# EAGLE design VFO_RTC_IQ3 (EAGLE 7.3.0)
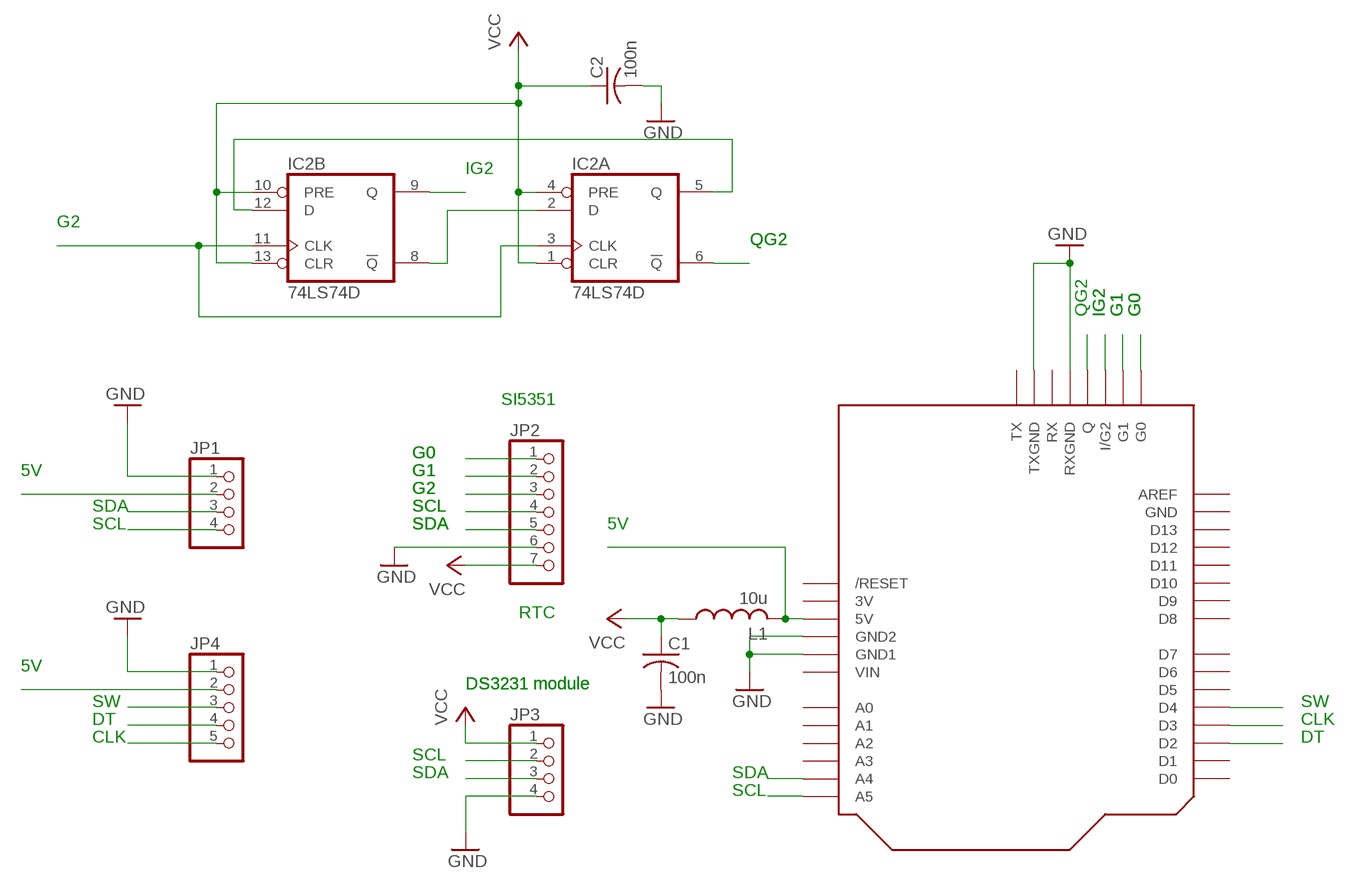
[diagram p0: schematic, sheet 1]

## Parts
C1  100n  C-US050-025X075  [C050-025X075]
C2  100n  C-US050-025X075  [C050-025X075]
IC2  74LS74D  [SO14]
JP1  PINHD-1X4  [1X04]
JP2  PINHD-1X7  [1X07]
JP3  PINHD-1X4  [1X04]
JP4  PINHD-1X5  [1X05]
L1  10u  L-US0207/10  [0207/10]
U$1  RF-SHIELD  [SHIELD-RF]

## Nets
5V: JP1.2 JP4.2 L1.2 U$1.5V
CLK: JP4.5 U$1.D3
DT: JP4.4 U$1.D2
G0: JP2.1 U$1.G0
G1: JP2.2 U$1.G1
G2: IC2.3(A:CLK) IC2.11(B:CLK) JP2.3
GND: C1.2 C2.2 JP1.1 JP2.6 JP3.4 JP4.1 U$1.GND1 U$1.GND2 U$1.RXGND U$1.TXGND
IG2: IC2.9(B:Q) U$1.I/G2
N$4: IC2.2(A:D) IC2.8(B:!Q)
N$7: IC2.5(A:Q) IC2.12(B:D)
QG2: IC2.6(A:!Q) U$1.Q
SCL: JP1.4 JP2.4 JP3.2 U$1.A5
SDA: JP1.3 JP2.5 JP3.3 U$1.A4
SW: JP4.3 U$1.D4
VCC: C1.1 C2.1 IC2.1(A:CLR) IC2.4(A:PRE) IC2.10(B:PRE) IC2.13(B:CLR) JP2.7 JP3.1 L1.1
Unconnected: U$1.A0 U$1.A1 U$1.A2 U$1.A3 U$1.AREF U$1.D0 U$1.D1 U$1.D5 U$1.D6 U$1.D7 U$1.D8 U$1.D9 U$1.D10 U$1.D11 U$1.D12 U$1.D13 U$1.RESET(/RESET) U$1.RX U$1.TX

## Notes on the sheet
- IG2
- G2
- QG2 | QG2
- QG2 | IG2 | IG2 | G1 | G1 | G0 | G0
- SI5351
- G0 | G0
- 5V | G1 | G1
- G2 | G2
- SDA | SCL | SCL
- SCL | SDA | SDA | 5V
- RTC
- 5V
- DS3231 module | DS3231 module
- SW | SW
- DT | CLK
- CLK | DT
- SCL
- SDA | SDA
- SCL

## Power pins joined to a net without a drawn wire
3V: U$1.3V
GND: IC2.7(P:GND) U$1.GND
VCC: IC2.14(P:VCC)
VIN: U$1.VIN

## Library data of the parts
C1 C2 = rcl:C-US: CAPACITOR, American symbol
IC2 = 74xx-us:74*74: Dual D type positive edge triggered FLIP FLOP, preset and clear
JP1 JP3 = pinhead:PINHD-1X4: PIN HEADER
JP2 = pinhead:PINHD-1X7: PIN HEADER
JP4 = pinhead:PINHD-1X5: PIN HEADER
L1 = rcl:L-US: INDUCTOR, American symbol
U$1 = Arduino-M6KWH:RF-SHIELD: Arduino shield M6KWH RFBUS

## Board
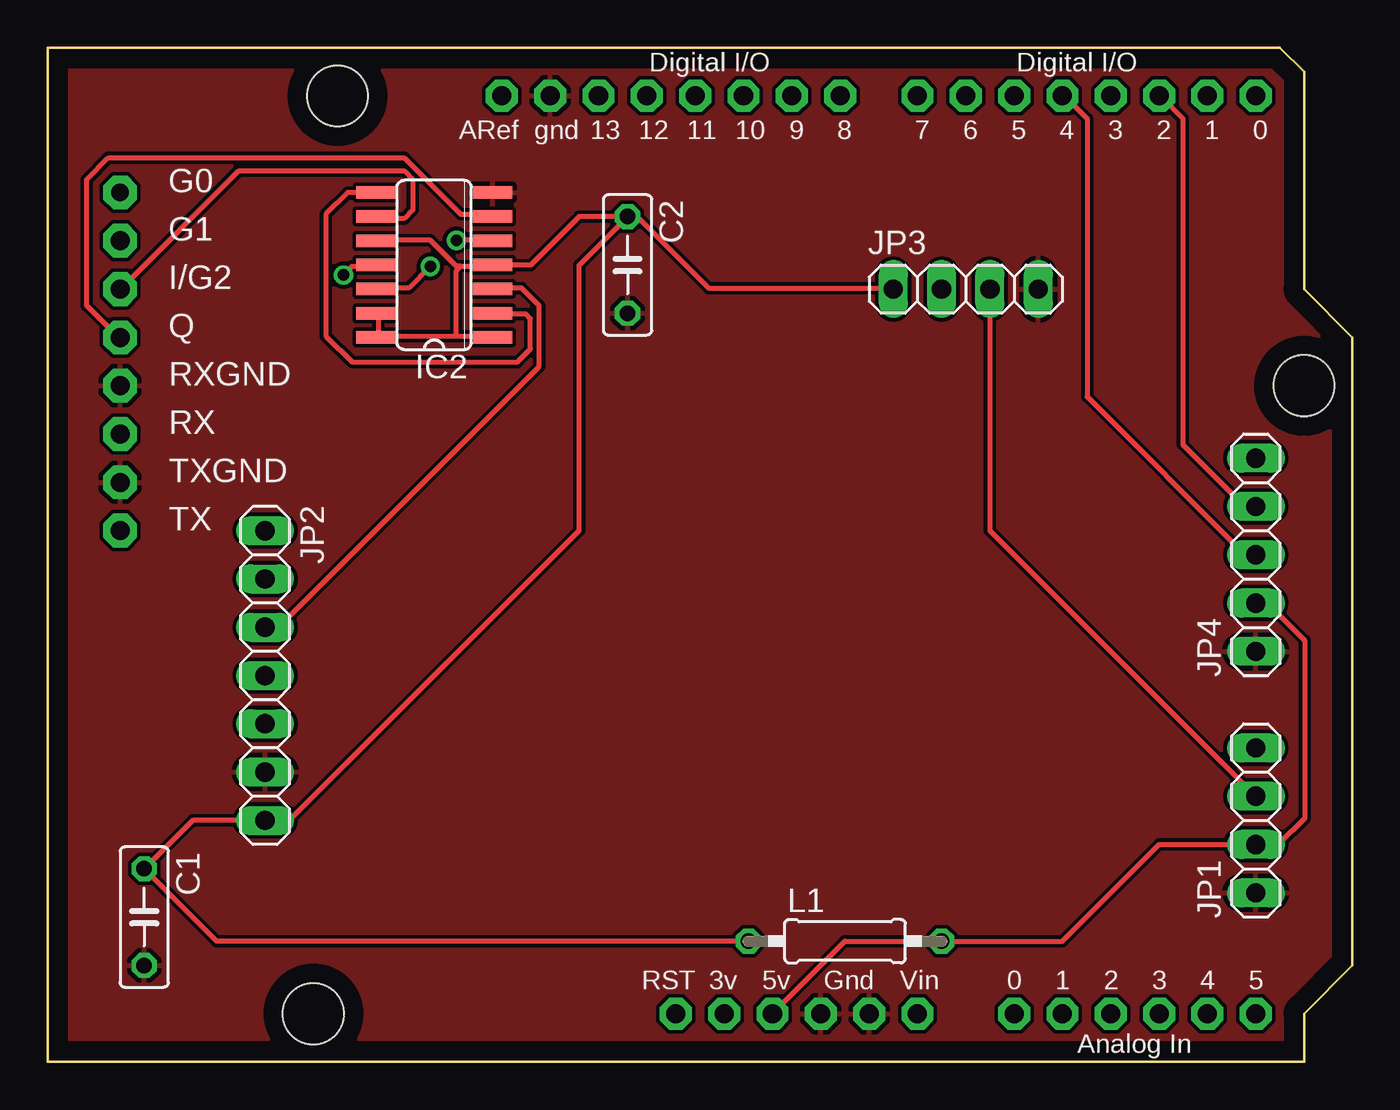
[diagram p1: board, top side]
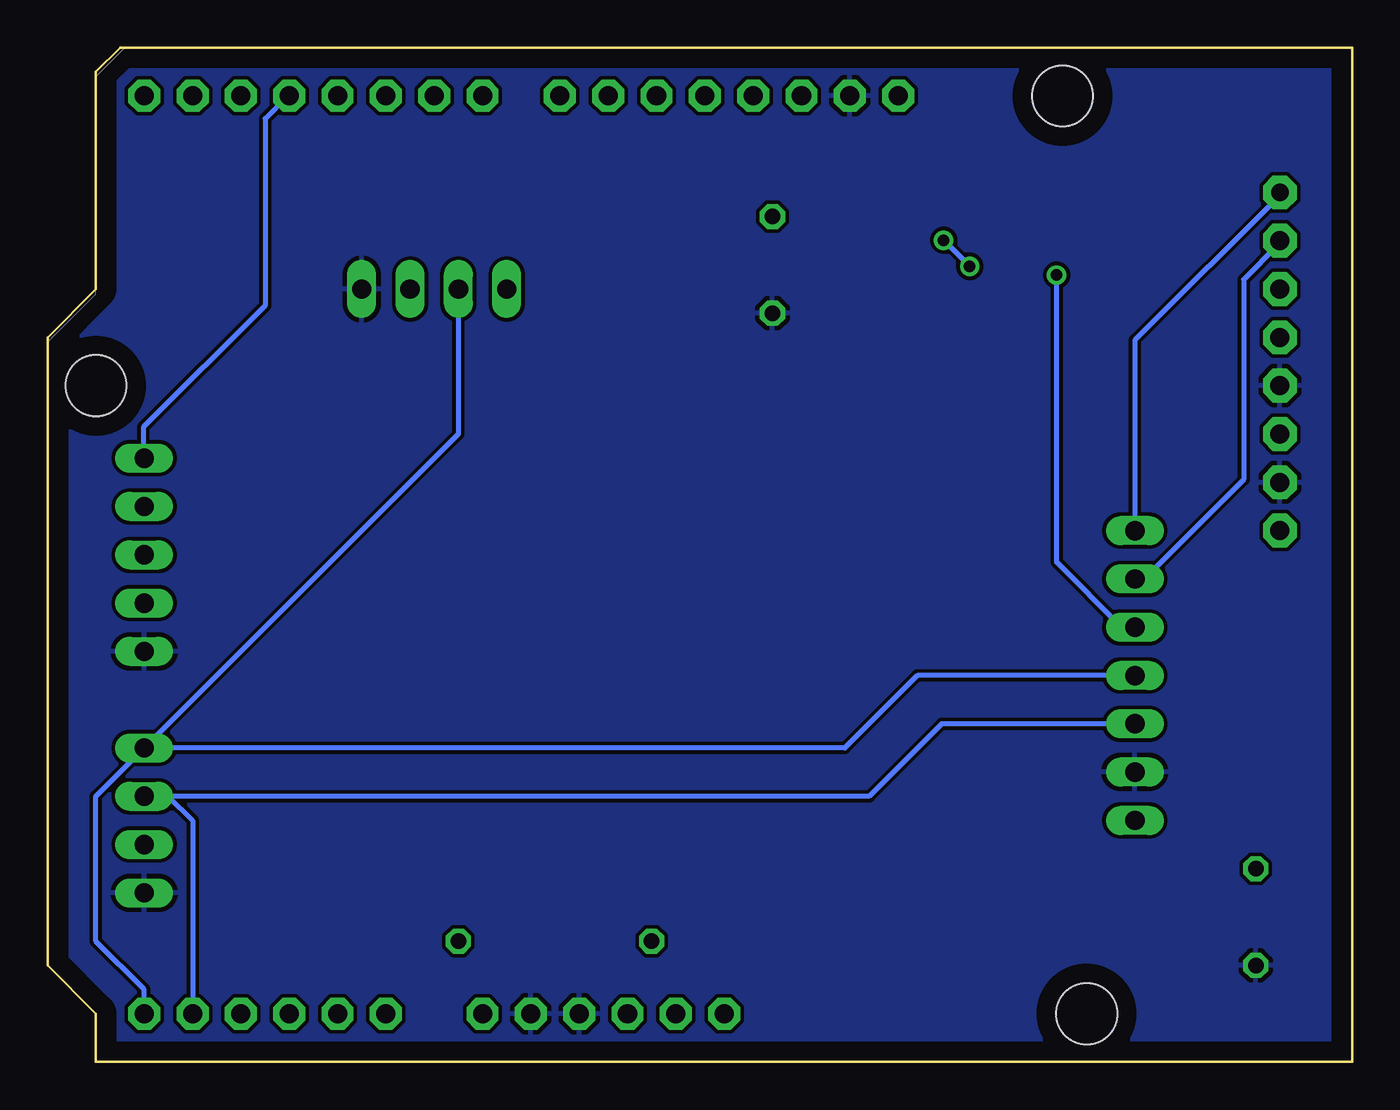
[diagram p2: board, bottom side, seen from below]

Size 68.58 x 53.34 mm. Coordinates in mm from the lower left corner, seen from the top.
Copper layers (1*16): Top 0.035mm / dielectric 1.5mm / Bottom 0.035mm
Design rules "default": minimum track width 10mil, minimum drill 24mil, track to track 8mil, track to pad 8mil, pad to pad 8mil, via to via 8mil, smd to smd 8mil, copper to edge 40mil, drill to drill 8mil, minimum pad ring 10mil, minimum via ring 8mil, stop-mask expansion 4mil, vias tented up to drill 0mil, thermal gap 10mil

### Footprints (pad centres in the part's own frame; a part is rotated, then mirrored left to right if it is on the bottom)
C050-025X075 = drill 0.813 octagon: 1 -2.54,0; 2 2.54,0
SO14 = smd 0.66 x 2.032: 1 -3.81,-3.073; 2 -2.54,-3.073; 3 -1.27,-3.073; 4 0,-3.073; 5 1.27,-3.073; 6 2.54,-3.073; 7 3.81,-3.073; 8 3.81,3.073; 9 2.54,3.073; 10 1.27,3.073; 11 0,3.073; 12 -1.27,3.073; 13 -2.54,3.073; 14 -3.81,3.073
1X04 = drill 1.016 long: 1 -3.81,0; 2 -1.27,0; 3 1.27,0; 4 3.81,0
1X07 = drill 1.016 long: 1 -7.62,0; 2 -5.08,0; 3 -2.54,0; 4 0,0; 5 2.54,0; 6 5.08,0; 7 7.62,0
1X05 = drill 1.016 long: 1 -5.08,0; 2 -2.54,0; 3 0,0; 4 2.54,0; 5 5.08,0
0207/10 = drill 0.813 octagon: 1 -5.08,0; 2 5.08,0
SHIELD-RF = drill 1 pad 1.676 octagon: 3V 35.56,2.54; 5V 38.1,2.54; A0 50.8,2.54; A1 53.34,2.54; A2 55.88,2.54; A3 58.42,2.54; A4 60.96,2.54; A5 63.5,2.54; AREF 23.876,50.8; D0 63.5,50.8; D1 60.96,50.8; D2 58.42,50.8; D3 55.88,50.8; D4 53.34,50.8; D5 50.8,50.8; D6 48.26,50.8; D7 45.72,50.8; D8 41.656,50.8; D9 39.116,50.8; D10 36.576,50.8; D11 34.036,50.8; D12 31.496,50.8; D13 28.956,50.8; GND 26.416,50.8; GND1 43.18,2.54; GND2 40.64,2.54; RESET 33.02,2.54; VIN 45.72,2.54 | drill 0.9 pad 1.778 octagon: G0 3.81,45.72 | drill 1 pad 1.778 octagon: G1 3.81,43.18; I/G2 3.81,40.64; Q 3.81,38.1; RX 3.81,33.02; RXGND 3.81,35.56; TX 3.81,27.94; TXGND 3.81,30.48 | hole 3.2: 15.24,50.8; 66.04,35.56; 13.97,2.54

### Placement (x,y rotation side)
C1  5.08,7.62 270 top
C2  30.48,41.91 270 top
IC2  20.32,41.91 90 top
JP1  63.5,12.7 90 top
JP2  11.43,20.32 270 top
JP3  48.26,40.64 0 top
JP4  63.5,26.67 90 top
L1  41.91,6.35 0 top
U$1  0,0 0 top

### Tracks (layer width: path | path; a pad name or v marks a point on that pad's centre or on a via)
5V
  Top 0.254: JP4.2 63.55,24 64.24,24 66.06,22.17 66.06,12.8 64.69,11.43 JP1.2 58.42,11.43 53.34,6.35 L1.2 41.91,6.35 U$1.5V
CLK
  Bottom 0.254: JP4.5 63.55,31.77 63.55,33.38 57.15,39.78 57.15,49.61 56.01,50.75 U$1.D3
DT
  Top 0.254: JP4.4 63.32,29.26 62.87,29.26 59.66,32.46 59.66,49.61 58.52,50.75 U$1.D2
G0
  Bottom 0.254: JP2.1 11.43,37.95 3.66,45.72 U$1.G0
G1
  Bottom 0.254: JP2.2 11.43,25.6 10.74,25.6 5.71,30.63 5.71,41.15 3.89,42.98 U$1.G1
G2  (via drill 0.61)
  Top 0.254: JP2.3 12.12,22.86 25.83,36.58 25.83,39.78 24.92,40.69 23.55,40.69 IC2.3 | v15.54,41.38 16,41.83 17.14,41.83 IC2.11
  Bottom 0.254: v15.54,41.38 15.54,26.29 12.12,22.86 JP2.3
GND
  pour Bottom: 0,53.34 64.77,53.34 66.04,52.07 66.04,40.64 68.58,38.1 68.58,5.08 66.04,2.54 66.04,0 0,0
  pour Top: 0,53.34 64.77,53.34 66.04,52.07 66.04,40.64 68.58,38.1 68.58,5.08 66.04,2.54 66.04,0 0,0
IG2
  Top 0.254: IC2.9 17.37,44.35 18.75,44.35 19.2,44.81 19.2,46.41 18.75,46.86 10.06,46.86 3.89,40.69 U$1.I/G2
N$4
  Top 0.254: IC2.8 15.77,45.72 14.63,44.58 14.63,38.18 16,36.8 24.69,36.8 25.38,37.49 25.38,39.09 25.15,39.32 23.55,39.32 IC2.2
N$7  (via drill 0.61)
  Top 0.254: v20.12,41.83 18.97,40.69 17.37,40.69 IC2.12 | v21.49,43.2 23.32,43.2 IC2.5
  Bottom 0.254: v21.49,43.2 v20.12,41.83
QG2
  Top 0.254: IC2.6 23.32,44.58 21.72,44.58 18.75,47.55 3.2,47.55 2.06,46.41 2.06,39.78 3.66,38.18 U$1.Q
SCL
  Bottom 0.254: JP3.2 46.99,33.02 JP1.4 | U$1.A5 63.5,3.81 66.04,6.35 66.04,13.97 JP1.4 | JP2.4 22.86,20.32 26.67,16.51 JP1.4
SDA
  Top 0.254: JP3.3 49.53,27.94 JP1.3
  Bottom 0.254: JP2.5 21.59,17.78 25.4,13.97 JP1.3 62.23,13.97 60.96,12.7 U$1.A4
SW
  Top 0.254: JP4.3 63.32,26.75 62.87,26.75 54.63,34.98 54.63,49.61 53.49,50.75 U$1.D4
VCC
  Top 0.254: 17.37,38.18 17.37,39.32 IC2.13 | 17.37,38.18 21.49,38.18 | 21.49,38.18 23.32,38.18 IC2.1 | 17.37,38.18 IC2.14 | 21.72,41.83 23.32,41.83 IC2.4 25.4,41.91 27.94,44.45 C2.1 | 21.72,41.83 21.49,41.6 21.49,38.18 | 21.72,41.83 21.49,41.83 20.12,43.2 17.37,43.2 IC2.10 | JP3.1 44.35,40.69 34.75,40.69 31.09,44.35 30.63,44.35 C2.1 | C2.1 27.94,41.91 27.94,27.94 12.7,12.7 JP2.7 7.62,12.7 C1.1 8.89,6.35 L1.1